# EAGLE design Decoder4_2 (EAGLE 6.5.0)

## Sheet 1 of 4
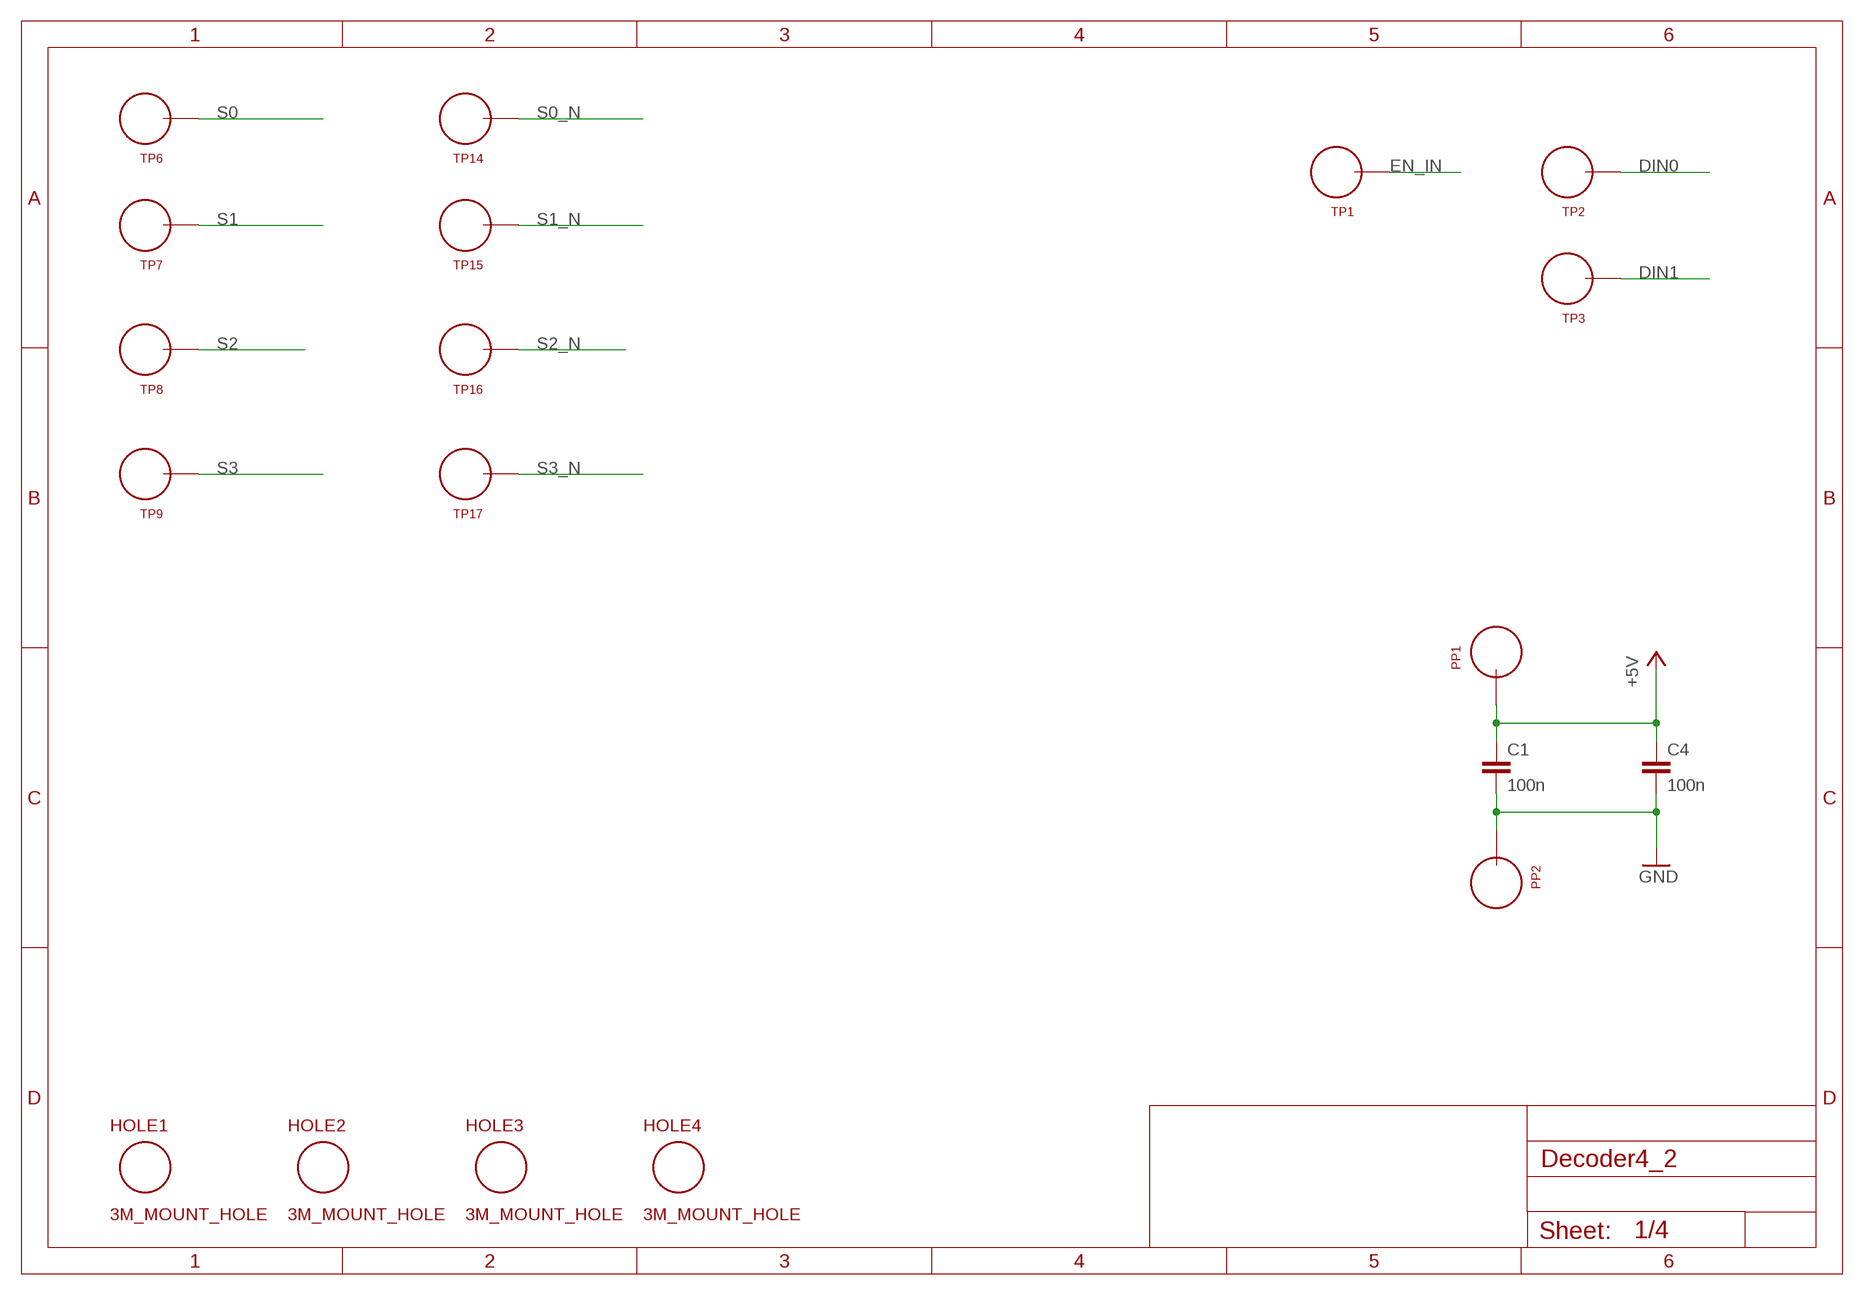
[diagram p0: schematic, sheet 1]

### Parts
C1  100n  C_P2INCH  [CAP_P2INCH]
C4  100n  C_P2INCH  [CAP_P2INCH]
HOLE1  3M_MOUNT_HOLE  [3M_HOLE]
HOLE2  3M_MOUNT_HOLE  [3M_HOLE]
HOLE3  3M_MOUNT_HOLE  [3M_HOLE]
HOLE4  3M_MOUNT_HOLE  [3M_HOLE]
PP1  TEST_LOOP  [TEST_LOOP]
PP2  TEST_LOOP  [TEST_LOOP]
TP1  TEST_LOOP  [TEST_LOOP]
TP2  TEST_LOOP  [TEST_LOOP]
TP3  TEST_LOOP  [TEST_LOOP]
TP6  TEST_LOOP  [TEST_LOOP]
TP7  TEST_LOOP  [TEST_LOOP]
TP8  TEST_LOOP  [TEST_LOOP]
TP9  TEST_LOOP  [TEST_LOOP]
TP14  TEST_LOOP  [TEST_LOOP]
TP15  TEST_LOOP  [TEST_LOOP]
TP16  TEST_LOOP  [TEST_LOOP]
TP17  TEST_LOOP  [TEST_LOOP]

### Nets
+5V: C1.1 C4.1 PP1.P$1 ; also sheet 2,3,4
DIN0: TP2.P$1 ; also sheet 2
DIN1: TP3.P$1 ; also sheet 2
EN_IN: TP1.P$1 ; also sheet 2
GND: C1.2 C4.2 PP2.P$1 ; also sheet 2,3,4
S0: TP6.P$1 ; also sheet 4
S0_N: TP14.P$1 ; also sheet 3,4
S1: TP7.P$1 ; also sheet 4
S1_N: TP15.P$1 ; also sheet 3,4
S2: TP8.P$1 ; also sheet 4
S2_N: TP16.P$1 ; also sheet 3,4
S3: TP9.P$1 ; also sheet 4
S3_N: TP17.P$1 ; also sheet 3,4

## Sheet 2 of 4
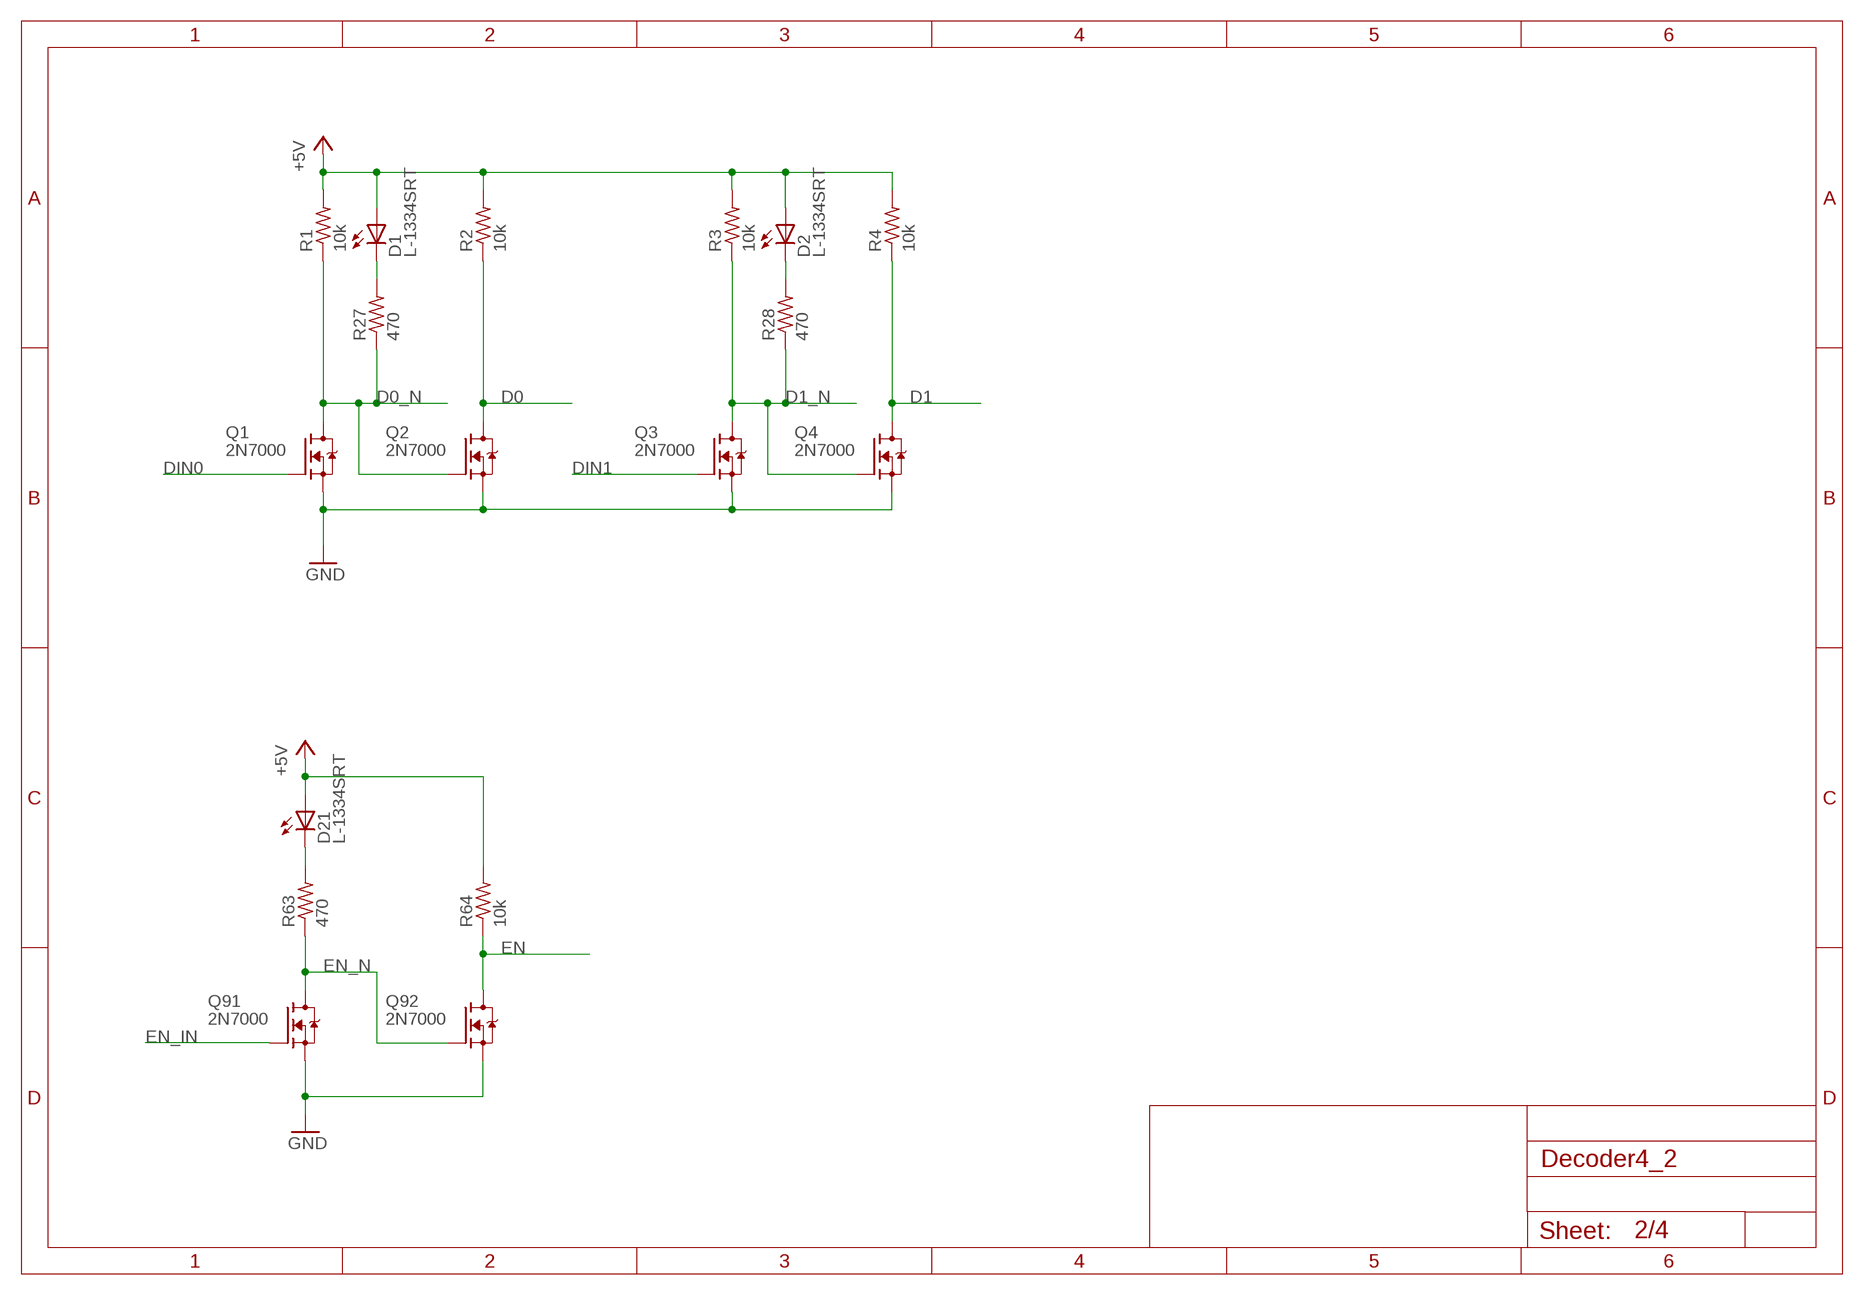
[diagram p1: schematic, sheet 2]

### Parts
D1  L-1334SRT  [LED3MM]
D2  L-1334SRT  [LED3MM]
D21  L-1334SRT  [LED3MM]
Q1  2N7000  [TO92-DGS]
Q2  2N7000  [TO92-DGS]
Q3  2N7000  [TO92-DGS]
Q4  2N7000  [TO92-DGS]
Q91  2N7000  [TO92-DGS]
Q92  2N7000  [TO92-DGS]
R1  10k  R_P2INCH  [R_P2INCH]
R2  10k  R_P2INCH  [R_P2INCH]
R3  10k  R_P2INCH  [R_P2INCH]
R4  10k  R_P2INCH  [R_P2INCH]
R27  470  R_P2INCH  [R_P2INCH]
R28  470  R_P2INCH  [R_P2INCH]
R63  470  R_P2INCH  [R_P2INCH]
R64  10k  R_P2INCH  [R_P2INCH]

### Nets
+5V: D1.A D2.A D21.A R1.2 R2.2 R3.2 R4.2 R64.2 ; also sheet 1,3,4
D0: Q2.D R2.1 ; also sheet 3
D0_N: Q1.D Q2.G R1.1 R27.1 ; also sheet 3
D1: Q4.D R4.1 ; also sheet 3
D1_N: Q3.D Q4.G R3.1 R28.1 ; also sheet 3
DIN0: Q1.G ; also sheet 1
DIN1: Q3.G ; also sheet 1
EN: Q92.D R64.1 ; also sheet 3
EN_IN: Q91.G ; also sheet 1
EN_N: Q91.D Q92.G R63.1
GND: Q1.S Q2.S Q3.S Q4.S Q91.S Q92.S ; also sheet 1,3,4
N$51: D1.K(C) R27.2
N$52: D2.K(C) R28.2
N$71: D21.K(C) R63.2

## Sheet 3 of 4
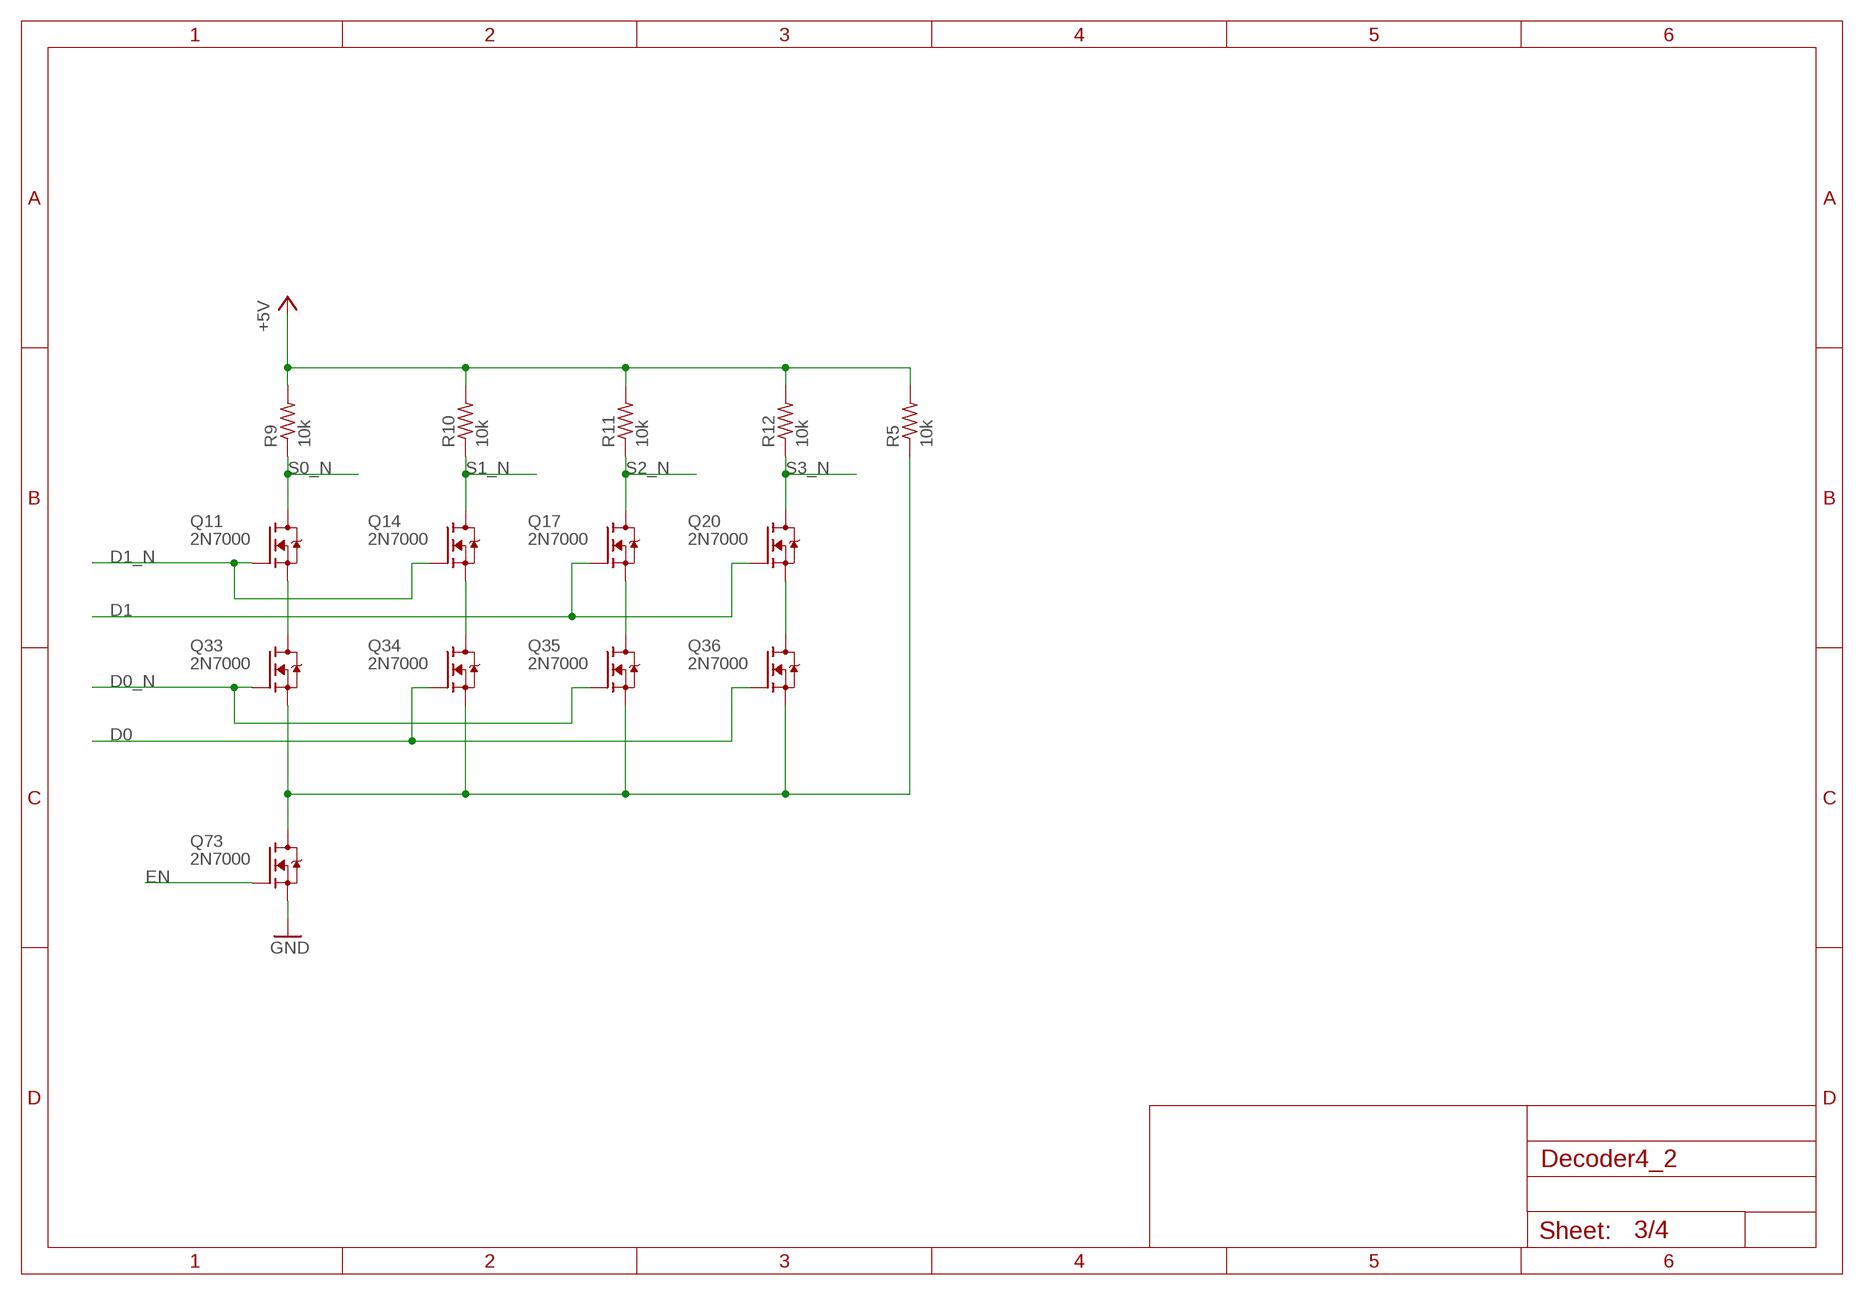
[diagram p2: schematic, sheet 3]

### Parts
Q11  2N7000  [TO92-DGS]
Q14  2N7000  [TO92-DGS]
Q17  2N7000  [TO92-DGS]
Q20  2N7000  [TO92-DGS]
Q33  2N7000  [TO92-DGS]
Q34  2N7000  [TO92-DGS]
Q35  2N7000  [TO92-DGS]
Q36  2N7000  [TO92-DGS]
Q73  2N7000  [TO92-DGS]
R5  10k  R_P2INCH  [R_P2INCH]
R9  10k  R_P2INCH  [R_P2INCH]
R10  10k  R_P2INCH  [R_P2INCH]
R11  10k  R_P2INCH  [R_P2INCH]
R12  10k  R_P2INCH  [R_P2INCH]

### Nets
+5V: R5.2 R9.2 R10.2 R11.2 R12.2 ; also sheet 1,2,4
D0: Q34.G Q36.G ; also sheet 2
D0_N: Q33.G Q35.G ; also sheet 2
D1: Q17.G Q20.G ; also sheet 2
D1_N: Q11.G Q14.G ; also sheet 2
EN: Q73.G ; also sheet 2
GND: Q73.S ; also sheet 1,2,4
N$18: Q33.S Q34.S Q35.S Q36.S Q73.D R5.1
N$19: Q11.S Q33.D
N$21: Q14.S Q34.D
N$22: Q17.S Q35.D
N$23: Q20.S Q36.D
S0_N: Q11.D R9.1 ; also sheet 1,4
S1_N: Q14.D R10.1 ; also sheet 1,4
S2_N: Q17.D R11.1 ; also sheet 1,4
S3_N: Q20.D R12.1 ; also sheet 1,4

## Sheet 4 of 4
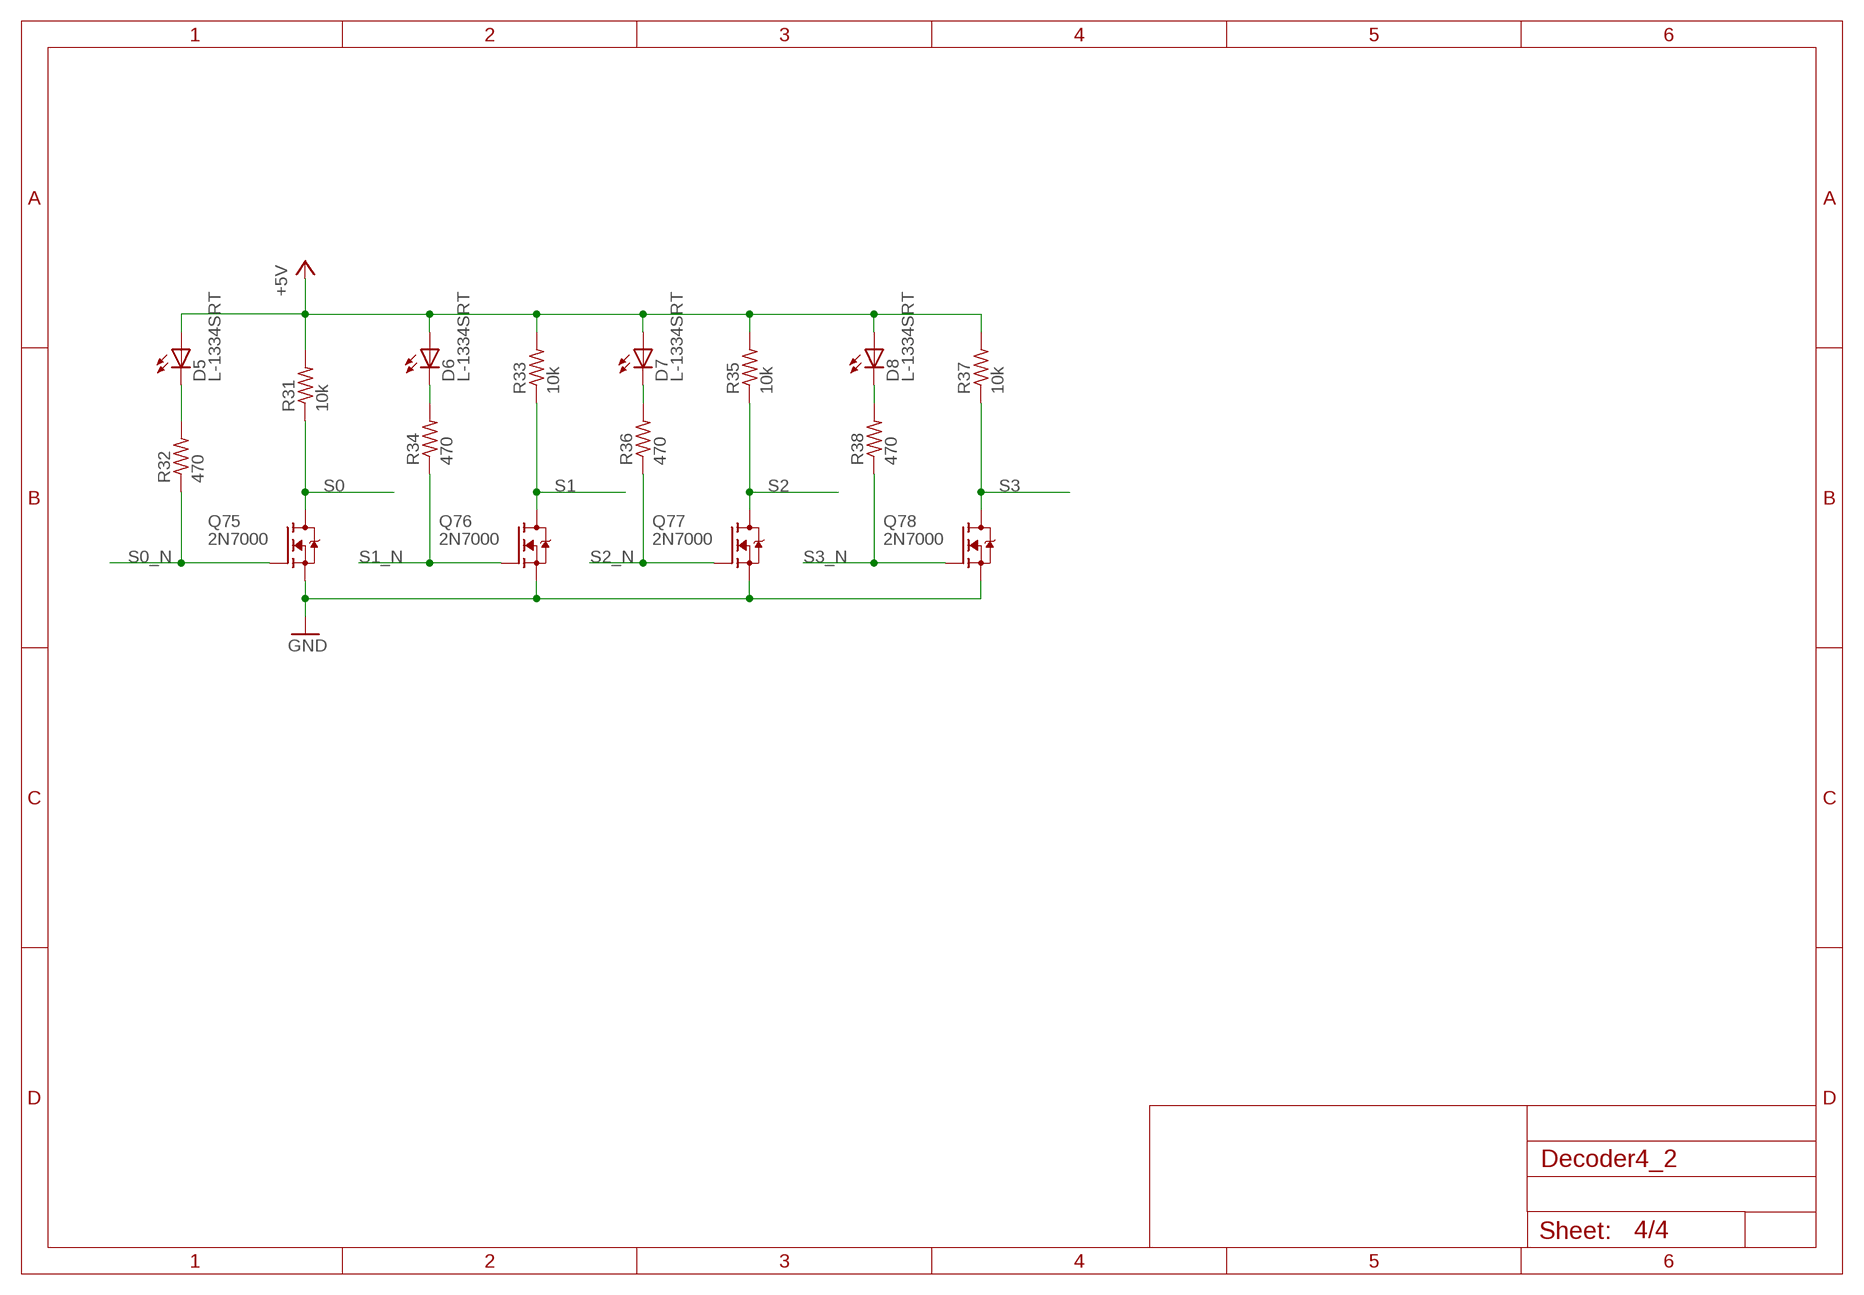
[diagram p3: schematic, sheet 4]

### Parts
D5  L-1334SRT  [LED3MM]
D6  L-1334SRT  [LED3MM]
D7  L-1334SRT  [LED3MM]
D8  L-1334SRT  [LED3MM]
Q75  2N7000  [TO92-DGS]
Q76  2N7000  [TO92-DGS]
Q77  2N7000  [TO92-DGS]
Q78  2N7000  [TO92-DGS]
R31  10k  R_P2INCH  [R_P2INCH]
R32  470  R_P2INCH  [R_P2INCH]
R33  10k  R_P2INCH  [R_P2INCH]
R34  470  R_P2INCH  [R_P2INCH]
R35  10k  R_P2INCH  [R_P2INCH]
R36  470  R_P2INCH  [R_P2INCH]
R37  10k  R_P2INCH  [R_P2INCH]
R38  470  R_P2INCH  [R_P2INCH]

### Nets
+5V: D5.A D6.A D7.A D8.A R31.2 R33.2 R35.2 R37.2 ; also sheet 1,2,3
GND: Q75.S Q76.S Q77.S Q78.S ; also sheet 1,2,3
N$55: D5.K(C) R32.2
N$57: D6.K(C) R34.2
N$59: D7.K(C) R36.2
N$61: D8.K(C) R38.2
S0: Q75.D R31.1 ; also sheet 1
S0_N: Q75.G R32.1 ; also sheet 1,3
S1: Q76.D R33.1 ; also sheet 1
S1_N: Q76.G R34.1 ; also sheet 1,3
S2: Q77.D R35.1 ; also sheet 1
S2_N: Q77.G R36.1 ; also sheet 1,3
S3: Q78.D R37.1 ; also sheet 1
S3_N: Q78.G R38.1 ; also sheet 1,3

## Library data of the parts
C1 C4 = MyLib:C_P2INCH
D1 D2 D5-D8 D21 = MyLib:L-1334SRT
HOLE1-HOLE4 = MyLib:3M_MOUNT_HOLE
PP1 PP2 TP1-TP3 TP6-TP9 TP14-TP17 = MyLib:TEST_LOOP
Q1-Q4 Q11 Q14 Q17 Q20 Q33-Q36 Q73 Q75-Q78 Q91 Q92 = MyLib:2N7000
R1-R5 R9-R12 R27 R28 R31-R38 R63 R64 = MyLib:R_P2INCH

## Board
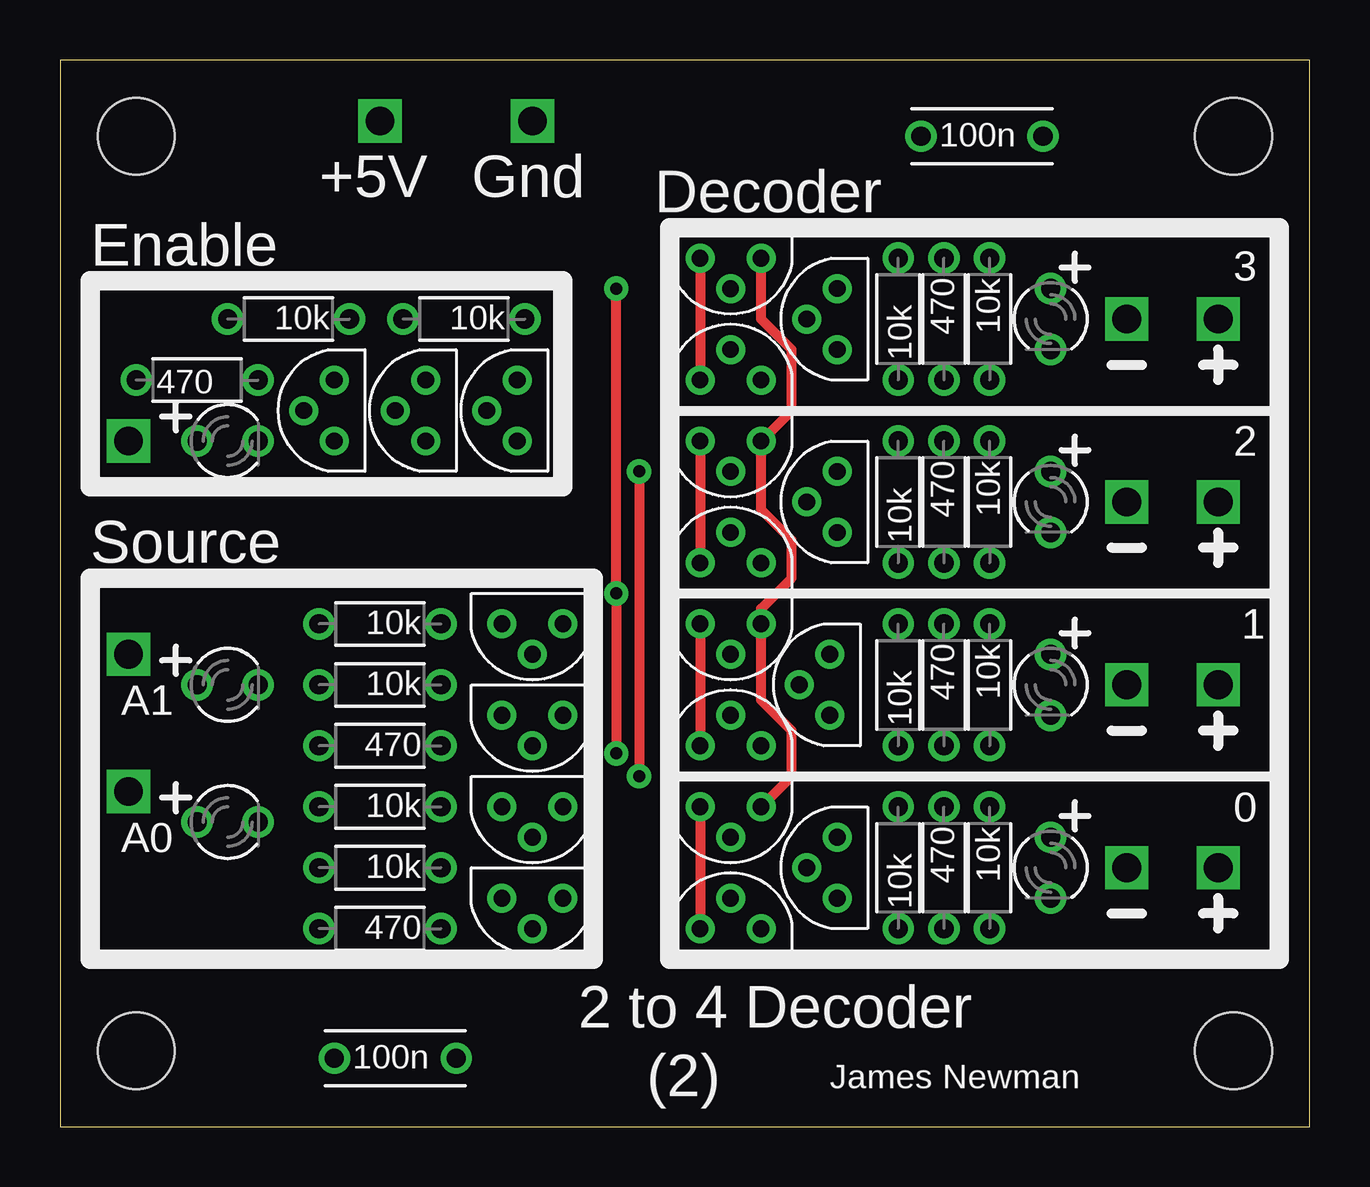
[diagram p4: board, top side]
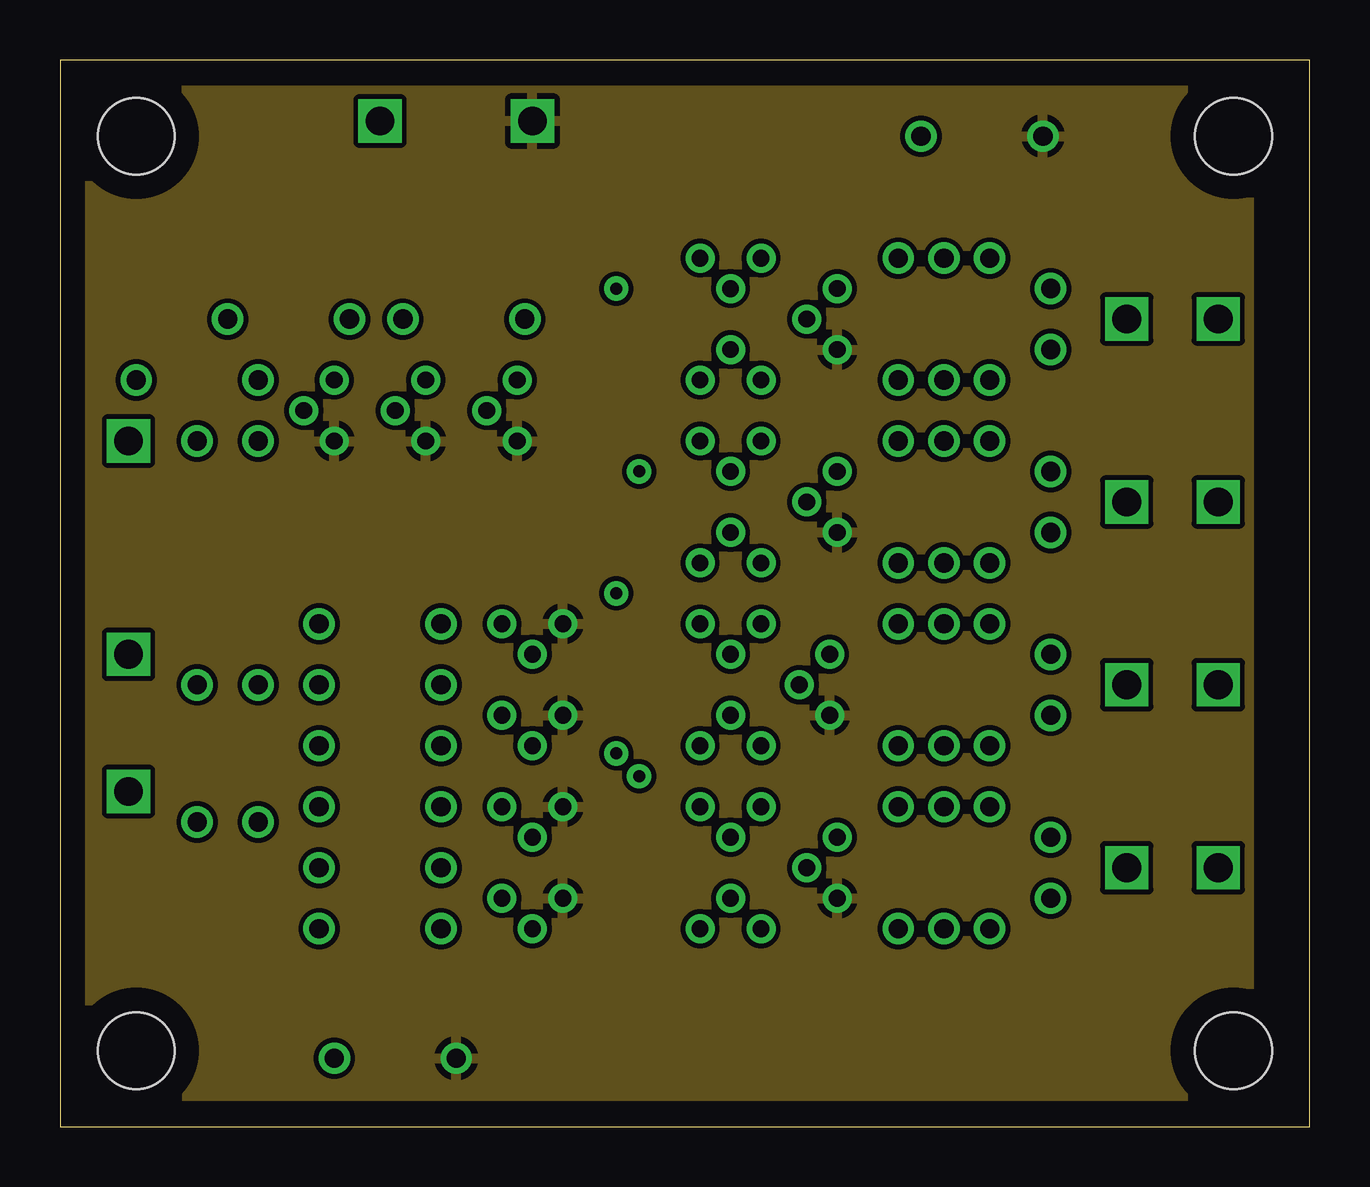
[diagram p5: board, inner layer Route2]
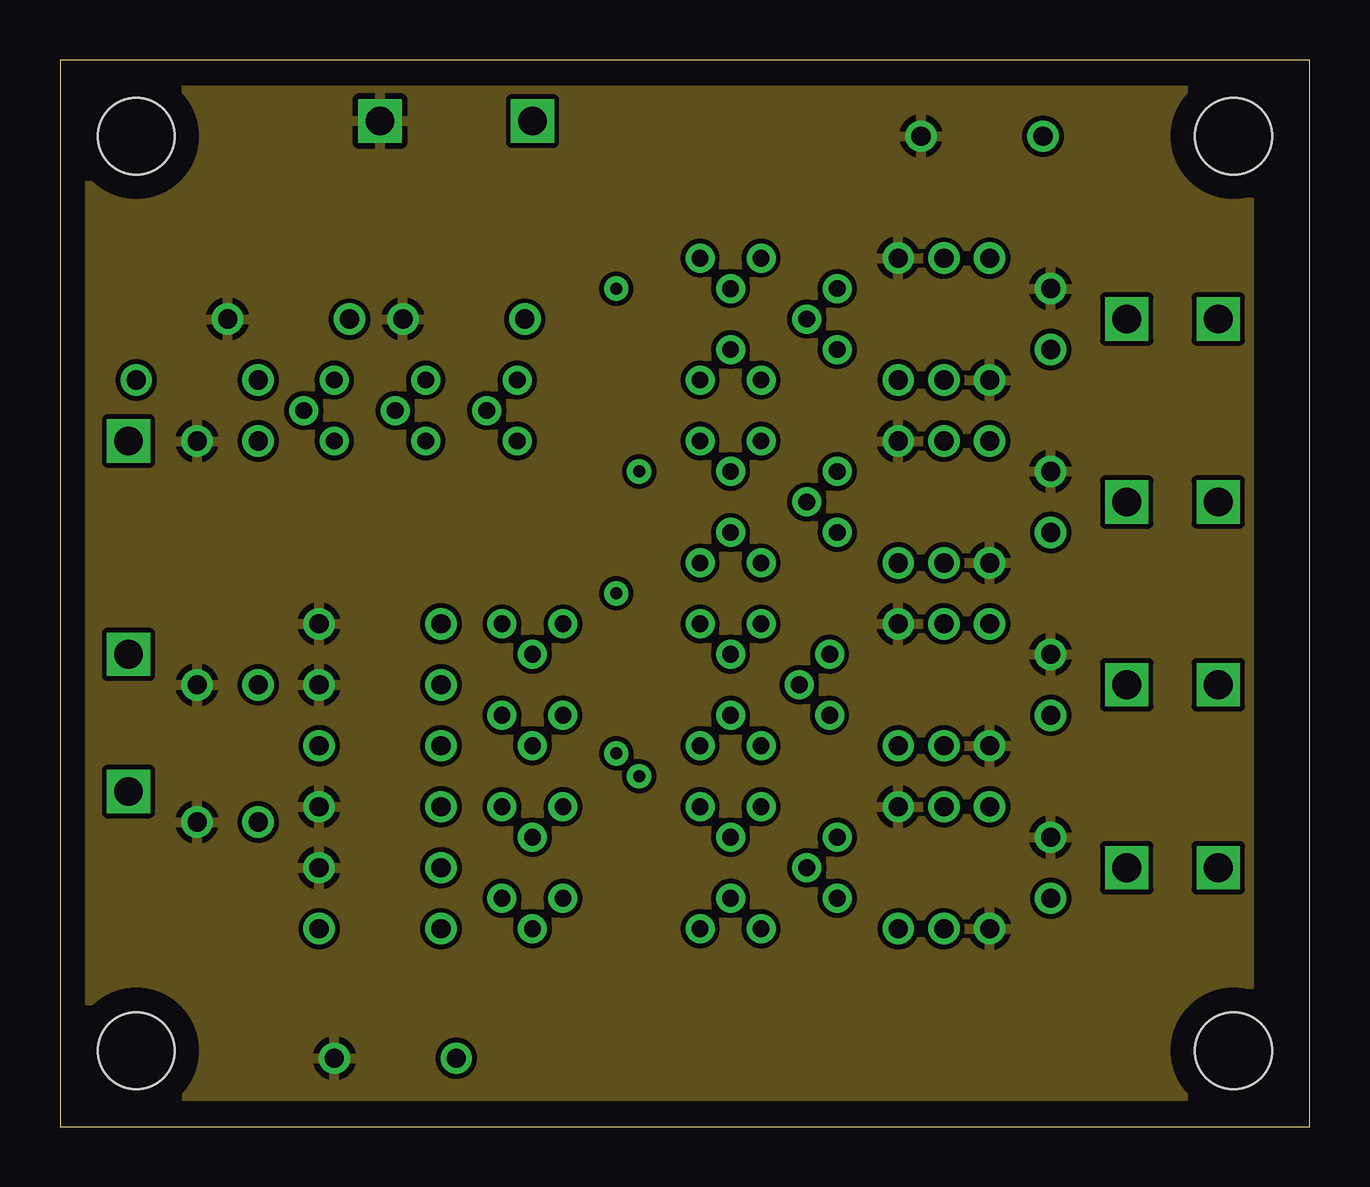
[diagram p6: board, inner layer Route3]
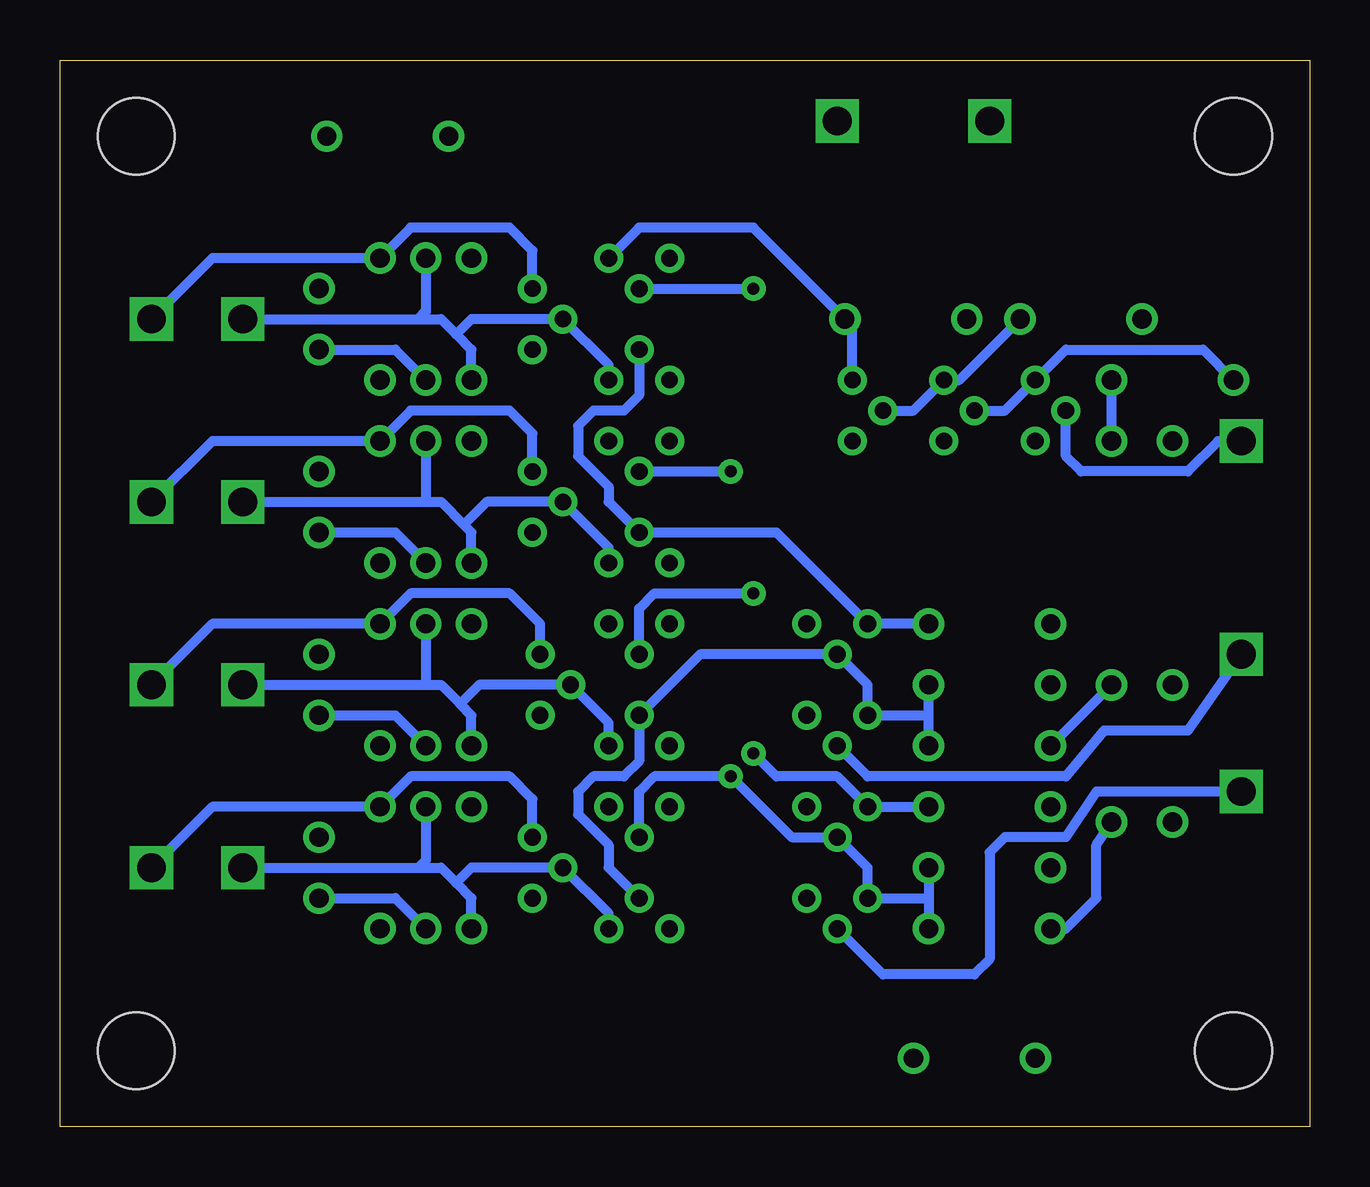
[diagram p7: board, bottom side, seen from below]

Size 52.07 x 44.45 mm. Coordinates in mm from the lower left corner, seen from the top.
Outline: 0,0 52.07,0 52.07,44.45 0,44.45 0,0
Copper layers (1*2+3*16): Top 0.035mm / dielectric 0.2mm / Route2 0.035mm / dielectric 1mm / Route3 0.035mm / dielectric 0.2mm / Bottom 0.035mm
Design rules "processor_rules_4layer": minimum track width 10mil, minimum drill 0.0236mm, track to track 8mil, track to pad 8mil, pad to pad 8mil, via to via 8mil, smd to smd 8mil, copper to edge 40mil, drill to drill 8mil, minimum pad ring 10mil, minimum via ring 8mil, stop-mask expansion 4mil, vias tented up to drill 0.7mm, thermal gap 10mil

### Footprints (pad centres in the part's own frame; a part is rotated, then mirrored left to right if it is on the bottom)
CAP_P2INCH = drill 0.8: 1 -2.54,0; 2 2.54,0
LED3MM = drill 0.8: A -1.27,0; K 1.27,0
3M_HOLE = hole 3.2: 0,0
TEST_LOOP = drill 1.2 square: P$1 0,0
TO92-DGS = drill 0.7: D 0,1.27; G -1.27,0; S 0,-1.27
R_P2INCH = drill 0.8: 1 -2.54,0; 2 2.54,0

### Placement (x,y rotation side)
C1  13.97,2.86 0 top
C4  38.42,41.27 0 top
D1  6.99,12.7 0 top
D2  6.99,18.41 0 top
D5  41.27,10.79 270 top
D6  41.27,18.41 270 top
D7  41.27,26.04 270 top
D8  41.27,33.66 270 top
D21  6.99,28.57 0 top
HOLE1  3.17,41.27 0 top
HOLE2  48.9,41.27 0 top
HOLE3  3.17,3.17 0 top
HOLE4  48.9,3.17 0 top
PP1  13.34,41.91 180 top
PP2  19.68,41.91 0 top
Q1  19.68,9.53 90 top
Q2  19.68,13.34 90 top
Q3  19.68,17.14 90 top
Q4  19.68,20.95 90 top
Q11  27.94,8.26 270 top
Q14  27.94,15.88 270 top
Q17  27.94,23.5 270 top
Q20  27.94,31.11 270 top
Q33  27.94,13.34 90 top
Q34  27.94,20.95 90 top
Q35  27.94,28.57 90 top
Q36  27.94,36.2 90 top
Q73  19.05,29.84 0 top
Q75  32.38,10.79 0 top
Q76  32.07,18.41 0 top
Q77  32.38,26.04 0 top
Q78  32.38,33.66 0 top
Q91  11.43,29.84 0 top
Q92  15.24,29.84 0 top
R1  13.34,10.79 180 top
R2  13.34,13.34 180 top
R3  13.34,18.41 180 top
R4  13.34,20.95 180 top
R5  16.83,33.66 180 top
R9  34.92,10.79 90 top
R10  34.92,18.41 90 top
R11  34.92,26.04 90 top
R12  34.92,33.66 90 top
R27  13.34,8.26 180 top
R28  13.34,15.88 180 top
R31  38.73,10.79 270 top
R32  36.83,10.79 270 top
R33  38.73,18.41 270 top
R34  36.83,18.41 270 top
R35  38.73,26.04 270 top
R36  36.83,26.04 270 top
R37  38.73,33.66 270 top
R38  36.83,33.66 270 top
R63  5.71,31.11 0 top
R64  9.53,33.66 180 top
TP1  2.86,28.57 0 top
TP2  2.86,13.97 0 top
TP3  2.86,19.68 0 top
TP6  48.26,10.79 270 top
TP7  48.26,18.41 270 top
TP8  48.26,26.04 270 top
TP9  48.26,33.66 270 top
TP14  44.45,10.79 270 top
TP15  44.45,18.41 270 top
TP16  44.45,26.04 270 top
TP17  44.45,33.66 270 top

### Tracks (layer width: path | path; a pad name or v marks a point on that pad's centre or on a via)
+5V
  pour Route3: 1.27,43.18 49.53,43.18 49.53,1.27 1.27,1.27
D0  (via drill 0.5 pad 1.02)
  Top 0.406: v23.18,15.56 v23.18,22.23 v23.18,34.92
  Bottom 0.406: R2.1 Q2.D 19.68,14.61 22.23,14.61 v23.18,15.56 | Q36.G v23.18,34.92 | Q34.G 27.94,21.59 27.3,22.23 v23.18,22.23
D0_N  (via drill 0.5 pad 1.02)
  Top 0.406: v24.13,27.3 v24.13,14.61
  Bottom 0.406: R1.1 15.88,9.53 | 15.88,9.53 R27.1 | 15.88,9.53 Q1.D 18.41,10.79 Q2.G 21.59,12.06 v24.13,14.61 27.3,14.61 27.94,13.97 Q33.G | Q35.G v24.13,27.3
D1
  Bottom 0.406: R4.1 Q4.D 22.23,24.77 Q17.G 29.21,26.04 29.21,26.67 30.48,27.94 30.48,29.21 29.84,29.84 28.57,29.84 27.94,30.48 Q20.G
D1_N
  Bottom 0.406: R28.1 15.88,17.14 | 15.88,17.14 R3.1 | 15.88,17.14 Q3.D 18.41,18.41 Q4.G 25.4,19.68 Q14.G 27.94,15.24 28.57,14.61 29.84,14.61 30.48,13.97 30.48,13.02 29.21,11.75 29.21,10.79 Q11.G
DIN0
  Bottom 0.406: TP2.P$1 8.89,13.97 10.16,12.06 12.7,12.06 13.34,11.43 13.34,6.99 13.97,6.35 17.78,6.35 Q1.G
DIN1
  Bottom 0.406: TP3.P$1 5.08,16.51 8.57,16.51 10.16,14.61 18.41,14.61 Q3.G
EN
  Bottom 0.406: Q73.G 16.51,29.84 Q92.D 14.61,31.11 R64.1
EN_IN
  Bottom 0.406: TP1.P$1 3.81,28.57 5.08,27.3 9.53,27.3 10.16,27.94 Q91.G
EN_N
  Bottom 0.406: R63.1 4.45,32.38 10.16,32.38 Q91.D 12.7,29.84 Q92.G
GND
  pour Route2: 1.27,43.18 49.53,43.18 49.53,1.27 1.27,1.27
N$18
  Top 0.406: Q33.S 30.48,14.61 30.48,16.51 29.21,17.78 Q34.S 29.21,21.59 30.48,22.86 30.48,24.45 29.21,25.72 Q35.S 30.48,29.84 30.48,32.38 29.21,33.66 Q36.S
  Bottom 0.406: Q73.D 19.05,33.34 R5.1 23.18,37.47 27.94,37.47 Q36.S
N$19
  Top 0.406: Q33.D Q11.S
N$21
  Top 0.406: Q34.D Q14.S
N$22
  Top 0.406: Q35.D Q17.S
N$23
  Top 0.406: Q36.D Q20.S
N$51
  Bottom 0.406: R27.2 10.16,8.26 8.89,9.53 8.89,11.75 D1.K
N$52
  Bottom 0.406: R28.2 D2.K
N$55
  Bottom 0.406: D5.K 38.1,9.53 R32.2
N$57
  Bottom 0.406: D6.K 38.1,17.14 R34.2
N$59
  Bottom 0.406: D7.K 38.1,24.77 R36.2
N$61
  Bottom 0.406: D8.K 38.1,32.38 R38.2
N$71
  Bottom 0.406: D21.K R63.2
S0
  Bottom 0.406: TP6.P$1 45.72,13.34 R31.1 37.47,14.61 33.34,14.61 32.38,13.65 Q75.D
S0_N
  Bottom 0.406: R9.1 34.92,9.53 35.56,10.16 | TP14.P$1 37.15,10.79 | 37.15,10.79 36.2,10.79 35.56,10.16 | 35.56,10.16 34.92,10.79 Q75.G 29.21,8.89 Q11.D | R32.1 36.83,11.11 37.15,10.79
S1
  Bottom 0.406: TP7.P$1 45.72,20.95 R33.1 37.47,22.23 33.34,22.23 32.07,20.95 Q76.D
S1_N
  Bottom 0.406: R10.1 34.92,17.14 35.4,17.62 | TP15.P$1 36.83,18.41 | 36.83,18.41 36.2,18.41 35.4,17.62 | 35.4,17.62 34.61,18.41 Q76.G 29.21,16.83 Q14.D | R34.1 36.83,18.41
S2
  Bottom 0.406: TP8.P$1 45.72,28.57 R35.1 37.47,29.84 33.34,29.84 32.38,28.89 Q77.D
S2_N
  Bottom 0.406: R11.1 34.92,24.77 35.24,25.08 | TP16.P$1 36.83,26.04 | 36.83,26.04 36.2,26.04 35.24,25.08 | 35.24,25.08 34.29,26.04 Q77.G 29.21,24.13 Q17.D | R36.1 36.83,26.04
S3
  Bottom 0.406: TP9.P$1 45.72,36.2 R37.1 37.47,37.47 33.34,37.47 32.38,36.51 Q78.D
S3_N
  Bottom 0.406: R12.1 34.92,32.38 35.56,33.02 | TP17.P$1 37.15,33.66 | 37.15,33.66 36.2,33.66 35.56,33.02 | 35.56,33.02 34.92,33.66 Q78.G 29.21,31.75 Q20.D | R38.1 36.83,33.97 37.15,33.66

### Text on the board
tPlace: +5V | Gnd | Decoder | Enable | 3 | 2 | Source | 1 | A1 | 0 | A0 | 2 to 4 Decoder | James Newman | (2)